# EAGLE design esp-sensor_01 (EAGLE 7.3.0)
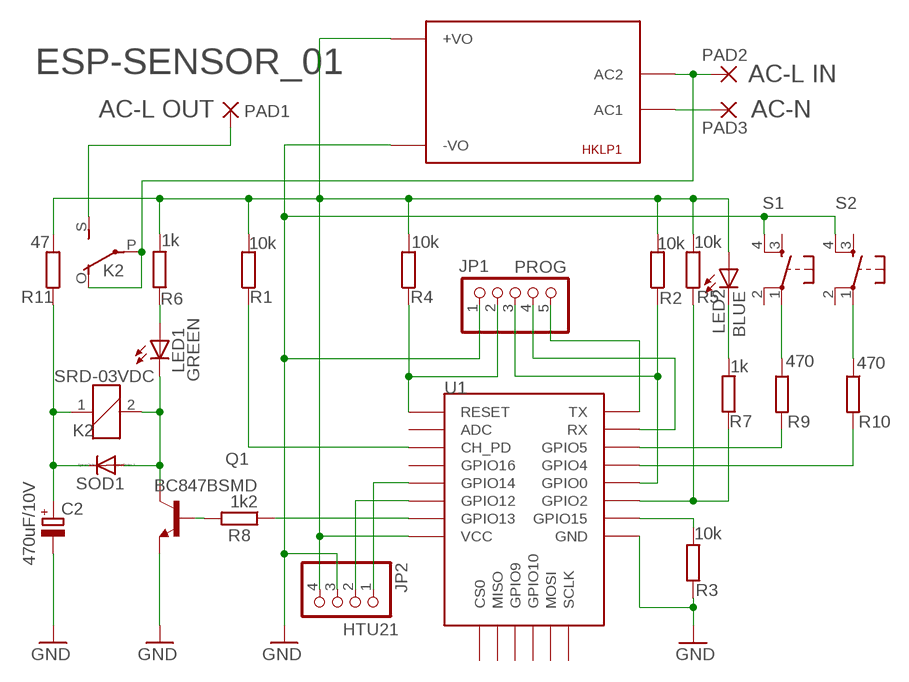
[diagram p0: schematic, sheet 1]

## Parts
C2  470uF/10V  CPOL-EUE3,5-8-B  [E3,5-8-B]
HKLP1  HKLPM01  [HKLPM01]
JP1  PROG  PINHD-1X51X05-2B  [1X05-2B]
JP2  HTU21  PINHD-1X4  [1X04]
K2  SRD-03VDC  G5L-2B  [G5L-2B]
LED1  GREEN  LEDB  [LED3MM-B]
LED2  BLUE  LEDB  [LED3MM-B]
PAD1  3,17/1,1  [3,17/1,1]
PAD2  3,17/1,1  [3,17/1,1]
PAD3  3,17/1,1  [3,17/1,1]
Q1  BC847BSMD  [SOT23]
R1  10k  R-EU_M1206  [M1206]
R2  10k  R-EU_M1206  [M1206]
R3  10k  R-EU_M1206  [M1206]
R4  10k  R-EU_M1206  [M1206]
R5  10k  R-EU_M1206  [M1206]
R6  1k  R-EU_M1206  [M1206]
R7  1k  R-EU_M1206  [M1206]
R8  1k2  R-EU_M1206  [M1206]
R9  470  R-EU_M1206  [M1206]
R10  470  R-EU_M1206  [M1206]
R11  47  R-EU_0207/10-2B  [0207/10-2B]
S1  DTS-6-B  [DTS-6-B]
S2  DTS-6-B  [DTS-6-B]
SOD1  DIODE-MELF-MLL41  [MELF-MLL41]
U1  ESP12ESMD  [ESP12E-SMD]

## Nets
3V3: HKLP1.P$4(+VO) JP2.4 LED2.A R1.2 R2.2 R4.2 R5.2 R6.2 R11.2 U1.VCC
GND: C2.- HKLP1.P$3(-VO) JP1.1 JP2.3 Q1.2(E) R3.1 S1.4 S2.4 U1.GND
N$1: Q1.1(B) R8.2
N$2: C2.+ K2.1 R11.1 SOD1.C
N$3: R8.1 U1.GPIO13
N$4: K2.2 LED1.K(C) Q1.3(C) SOD1.A
N$5: R1.1 U1.CH_PD
N$6: HKLP1.P$2(AC2) K2.O(2:O) K2.P(2:P) PAD2.1(P)
N$8: K2.S(2:S) PAD1.1(P)
N$9: R5.1 R7.1 U1.GPIO2
N$10: R3.2 U1.GPIO15
N$11: JP1.2 R4.1 U1.RESET
N$12: R9.1 S1.1
N$13: R10.1 S2.1
N$14: LED2.K(C) R7.2
N$15: LED1.A R6.1
N$16: JP1.3 R2.1 U1.GPIO0
N$17: JP1.5 U1.TXD0(TX)
N$18: R9.2 U1.GPIO5
N$19: R10.2 U1.GPIO4
N$20: JP1.4 U1.RXD0(RX)
N$21: HKLP1.P$1(AC1) PAD3.1(P)
N$22: JP2.2 U1.GPIO12
N$23: JP2.1 U1.GPIO14
Unconnected: S1.2 S1.3 S2.2 S2.3 U1.ADC U1.CS0 U1.GPIO9 U1.GPIO10 U1.GPIO16 U1.MISO U1.MOSI U1.SCLK

## Notes on the sheet
- ESP-SENSOR_01
- AC-L IN
- AC-L OUT | AC-N

## Library data of the parts
C2 = rcl:CPOL-EU: POLARIZED CAPACITOR, European symbol
HKLP1 = HKLPM01:HKLPM01
JP1 = pinhead:PINHD-1X5: PIN HEADER
JP2 = pinhead:PINHD-1X4: PIN HEADER
K2 = relay:G5L: RELAY 1 x switch, 10 A/120 V AC, 8 A/30 V ADC, Omron
LED1 LED2 = led:LED: LED OSRAM: - CHIPLED LG R971, LG N971, LY N971, LG Q971, LY Q971, LO R971, LY R971 LH N974, LH R974 LS Q976, LO Q976, LY Q976 LO Q996 - Hyper CHIPLED LW Q18S LB Q993, LB Q99A, LB R99A - SideLED LS A670, LO A670, LY A670, LG A670, LP A670 LB A673, LV A673, LT A673, LW A673 LH A674 LY A675 LS A676, LA A676, LO A676, LY A676, LW A676 LS A679, LY A679, LG A679 - Hyper Micro SIDELED® LS Y876, LA Y876, LO Y876, LY Y876 LT Y87S - SmartLED LW L88C, LW L88S LB L89C, LB L89S, LG L890 LS L89K, LO L89K, LY L89K LS L896, LA L896, LO L896, LY L896 - TOPLED LS T670, LO T670, LY T670, LG T670, LP T670 LSG T670, LSP T670, LSY T670, LOP T670, LYG T670 LG T671, LOG T671, LSG T671 LB T673, LV T673, LT T673, LW T673 LH T674 LS T676, LA T676, LO T676, LY T676, LB T676, LH T676, LSB T676, LW T676 LB T67C, LV T67C, LT T67C, LS T67K, LO T67K, LY T67K, LW E67C LS E67B, LA E67B, LO E67B, LY E67B, LB E67C, LV E67C, LT E67C LW T67C LS T679, LY T679, LG T679 LS T770, LO T770, LY T770, LG T770, LP T770 LB T773, LV T773, LT T773, LW T773 LH T774 LS E675, LA E675, LY E675, LS T675 LS T776, LA T776, LO T776, LY T776, LB T776 LHGB T686 LT T68C, LB T68C - Hyper Mini TOPLED® LB M676 - Mini TOPLED Santana® LG M470 LS M47K, LO M47K, LY M47K Source: http://www.osram.convergy.de LUXEON: - LUMILED® LXK2-PW12-R00, LXK2-PW12-S00, LXK2-PW14-U00, LXK2-PW14-V00 LXK2-PM12-R00, LXK2-PM12-S00, LXK2-PM14-U00 LXK2-PE12-Q00, LXK2-PE12-R00, LXK2-PE12-S00, LXK2-PE14-T00, LXK2-PE14-U00 LXK2-PB12-K00, LXK2-PB12-L00, LXK2-PB12-M00, LXK2-PB14-N00, LXK2-PB14-P00, LXK2-PB14-Q00 LXK2-PR12-L00, LXK2-PR12-M00, LXK2-PR14-Q00, LXK2-PR14-R00 LXK2-PD12-Q00, LXK2-PD12-R00, LXK2-PD12-S00 LXK2-PH12-R00, LXK2-PH12-S00 LXK2-PL12-P00, LXK2-PL12-Q00, LXK2-PL12-R00 Source: www.luxeon.com KINGBRIGHT: KA-3528ASYC Source: www.kingbright.com
PAD1-PAD3 = wirepad:3,17/1,1: THROUGH-HOLE PAD
Q1 = transistor-npn:BC847*: NPN Transistor
R1-R11 = rcl:R-EU_: RESISTOR, European symbol
S1 S2 = switch-tact:DTS-6
SOD1 = diode:DIODE-: DIODE
U1 = esp8266modules:ESP12E: ESP12E Module

## Board
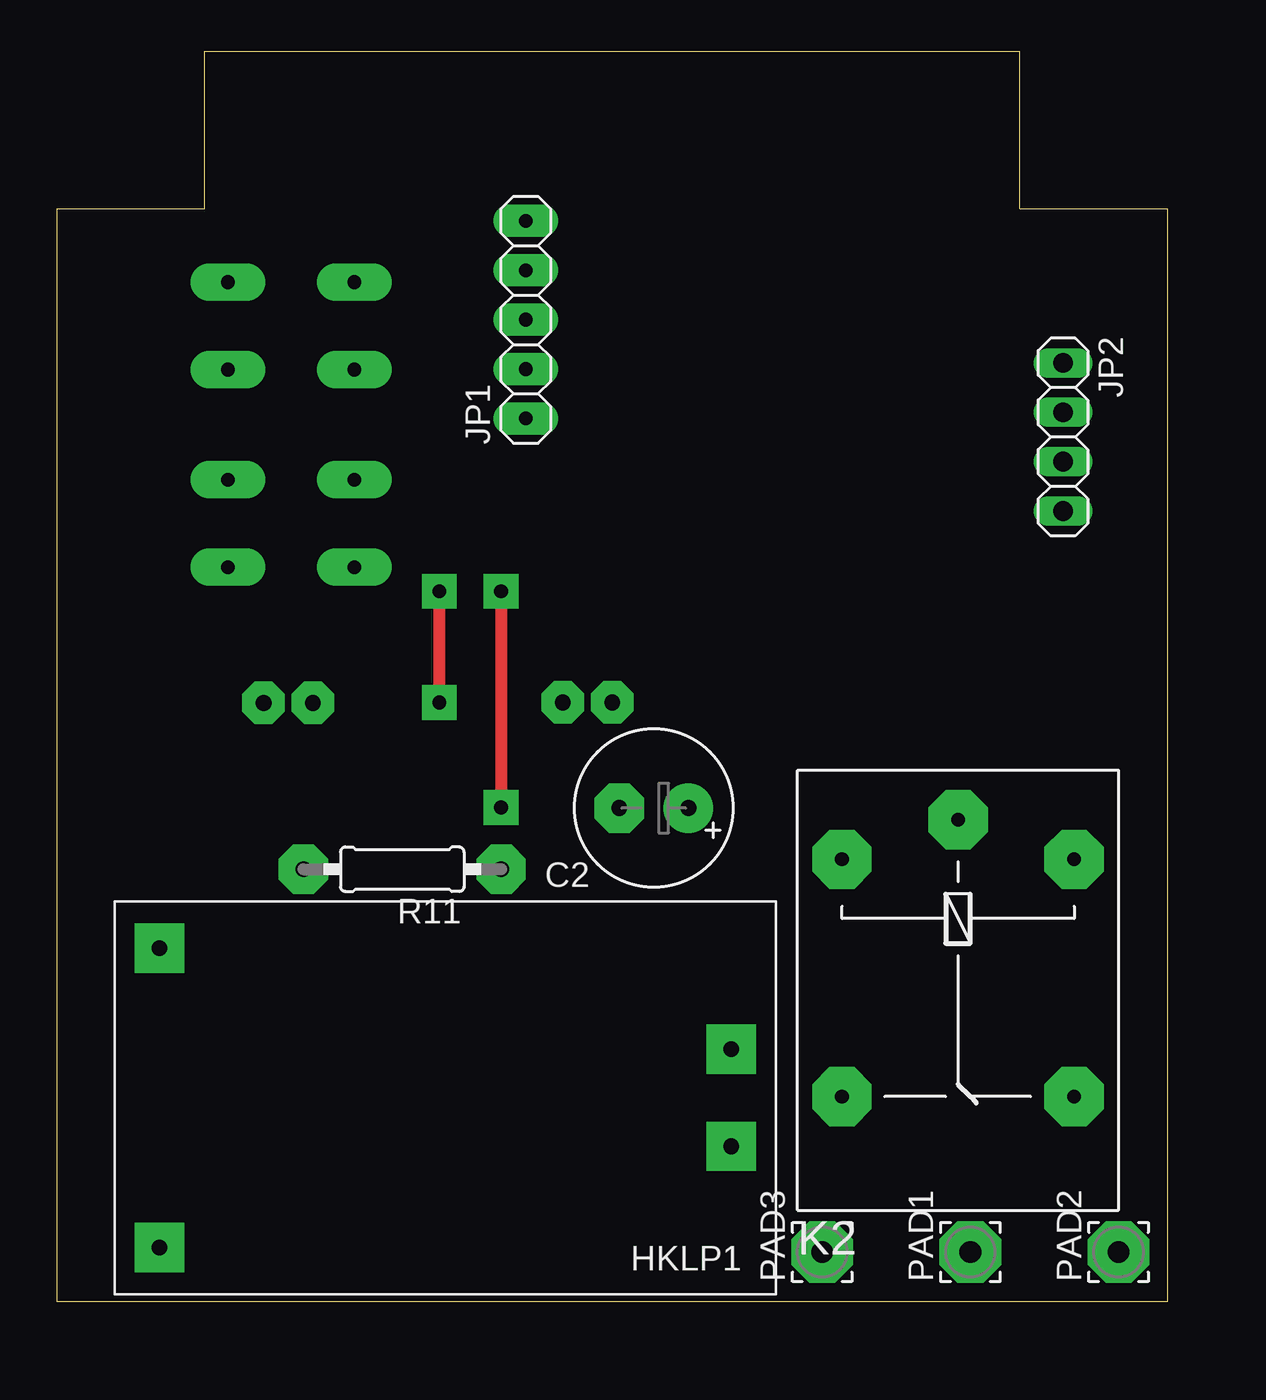
[diagram p1: board, top side]
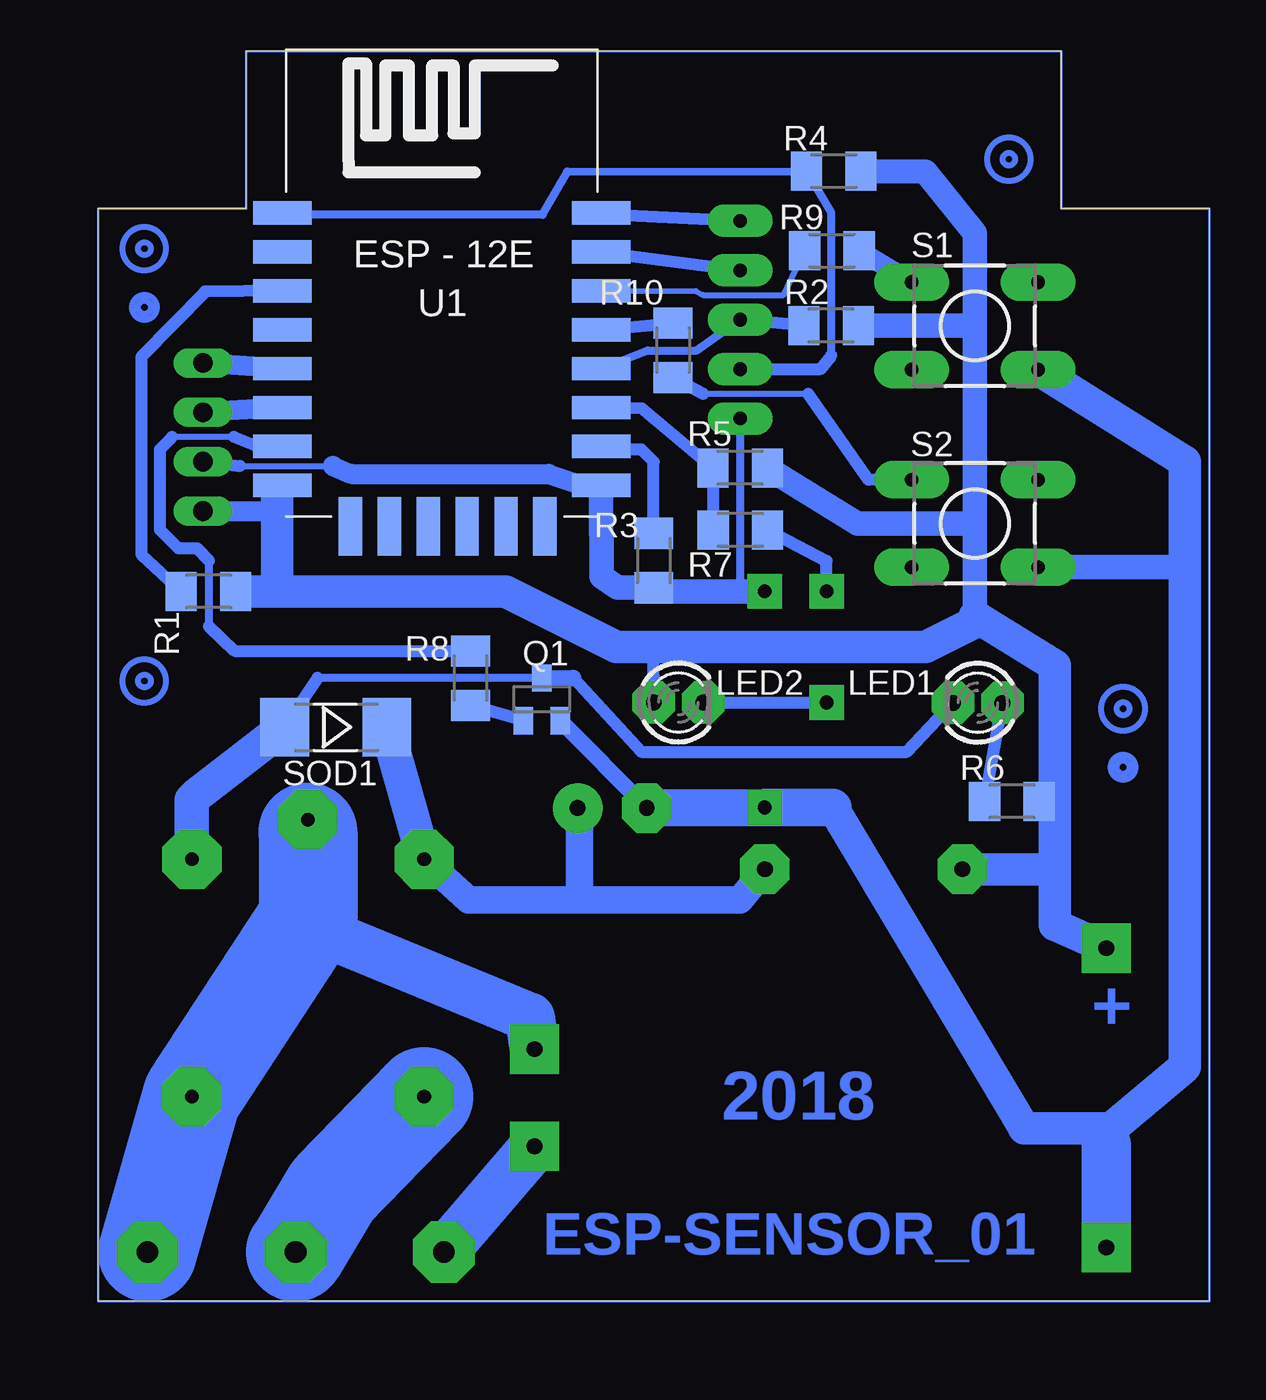
[diagram p2: board, bottom side, seen from below]

Size 57.15 x 64.29 mm. Coordinates in mm from the lower left corner, seen from the top.
Outline: 57.14,56.19 57.14,0 0,0 0,56.19
Outline: 57.15,56.2 49.53,56.2 49.53,64.29 7.62,64.29 7.62,56.2 0,56.2
Copper layers (1*16): Top 0.035mm / dielectric 1.5mm / Bottom 0.035mm
Design rules "default": minimum track width 10mil, minimum drill 24mil, track to track 8mil, track to pad 8mil, pad to pad 8mil, via to via 8mil, smd to smd 8mil, copper to edge 40mil, drill to drill 8mil, minimum pad ring 10mil, minimum via ring 8mil, stop-mask expansion 4mil, vias tented up to drill 0mil, thermal gap 10mil

### Footprints (pad centres in the part's own frame; a part is rotated, then mirrored left to right if it is on the bottom)
E3,5-8-B = drill 0.813 pad 2.54: + -1.778,0 | drill 0.813 pad 2.54 octagon: - 1.778,0
HKLPM01 = drill 0.8 pad 2.54 square: P$1 -14.7,2.5; P$2 -14.7,-2.5; P$3 14.7,7.7; P$4 14.7,-7.7
1X05-2B = drill 0.7 pad 1.676 long: 1 -5.08,0; 2 -2.54,0; 3 0,0; 4 2.54,0; 5 5.08,0
1X04 = drill 1.016 long: 1 -3.81,0; 2 -1.27,0; 3 1.27,0; 4 3.81,0
G5L-2B = drill 0.7 pad 3.048 octagon: 1 -7.493,-5.969; 2 -7.493,5.969; O 4.699,5.969; P -9.525,0; S 4.699,-5.969
LED3MM-B = drill 0.813 pad 2.184 octagon: A -1.27,0; K 1.27,0
3,17/1,1 = drill 1.118 pad 3.175 octagon: 1 0,0
SOT23 = smd 1 x 1.4: 1 -0.95,-1.1; 2 0.95,-1.1; 3 0,1.1
M1206 = smd 1.6 x 2: 1 -1.4,0; 2 1.4,0
0207/10-2B = drill 0.813 pad 2.54 octagon: 1 -5.08,0; 2 5.08,0
DTS-6-B = drill 0.7 pad 1.93 long: 1 -3.25,2.25; 2 3.25,2.25; 3 -3.25,-2.25; 4 3.25,-2.25
MELF-MLL41 = smd 2.5 x 3: A 2.625,0; C -2.625,0
ESP12E-SMD = smd 3 x 1.2: ADC -8.3,3.8; CH_PD -8.3,1.8; GND 8.1,-8.2; GPIO0 8.1,-2.2; GPIO2 8.1,-4.2; GPIO4 8.1,-0.2; GPIO5 8.1,1.8; GPIO12 -8.3,-4.2; GPIO13 -8.3,-6.2; GPIO14 -8.3,-2.2; GPIO15 8.1,-6.2; GPIO16 -8.3,-0.2; RESET -8.3,5.8; RXD0 8.1,3.8; TXD0 8.1,5.8; VCC -8.3,-8.2 | smd 1.2 x 3: CS0 -4.8,-10.3; GPIO9 -0.8,-10.3; GPIO10 1.2,-10.3; MISO -2.8,-10.3; MOSI 3.2,-10.3; SCLK 5.2,-10.3

### Placement (x,y rotation side)
C2  30.71,25.37 180 top
HKLP1  20,10.48 180 top
JP1  24.13,50.48 90 top
JP2  51.75,44.45 270 top
K2  46.35,15.24 270 top
LED1  11.92,30.78 180 bottom
LED2  27.3,30.81 0 bottom
PAD1  46.99,2.54 90 top
PAD2  54.61,2.54 90 top
PAD3  39.37,2.54 90 top
Q1  34.33,30.96 0 bottom
R1  51.47,36.51 0 bottom
R2  19.45,50.18 0 bottom
R3  28.57,38.1 90 bottom
R4  19.32,58.11 0 bottom
R5  24.13,42.86 0 bottom
R6  10.16,25.72 0 bottom
R7  24.12,39.66 0 bottom
R8  37.99,32.05 270 bottom
R9  19.41,54.03 180 bottom
R10  27.59,48.91 90 bottom
R11  17.78,22.23 180 top
S1  12.06,50.16 0 bottom
S2  12.06,40.01 0 bottom
SOD1  44.93,29.53 180 bottom
U1  39.37,50.16 0 bottom

### Tracks (layer width: path | path; a pad name or v marks a point on that pad's centre or on a via)
3V3
  Bottom 0.305: R6.2 7.94,26.67
  Bottom 0.406: R1.2 49.53,36.51 | 47.94,36.83 47.94,36.51
  Bottom 0.61: LED2.A 28.57,33.66
  Bottom 0.813: 47.94,41.59 U1.VCC
  Bottom 1.016: 47.94,36.83 47.97,39.05 | JP2.4 47.94,40.64
  Bottom 1.27: 12.06,35.24 12.06,40.01 | 12.06,40.01 12.06,50.16 | 12.06,50.16 12.06,54.93 14.61,58.1 R4.2 | R2.2 12.54,50.17 12.06,50.16 | R5.2 18.1,40.01 12.06,40.01
  Bottom 1.676: 47.94,36.83 47.94,40.64 47.94,41.59 | 49.53,36.51 47.94,36.51 36.2,36.51 30.48,33.66 28.57,33.66 14.61,33.66 11.78,35.07 | 7.94,22.23 7.94,19.37 HKLP1.P$4 | 7.94,22.23 7.94,26.67 7.94,32.7 11.78,35.07 | 11.78,35.07 12.06,35.24 | R11.2 7.94,22.23
GND  (via drill 0.7 pad 1.78)
  Top 0.61: v22.86,36.51 v22.86,25.4
  Bottom 0.305: 1.89,37.76 1.27,37.78 | 49.85,42.97 45.09,42.97
  Bottom 0.406: JP1.1 24.13,36.51
  Bottom 0.61: 31.27,41.38 U1.GND | 27.94,36.51 R3.1 | JP2.3 49.85,42.97
  Bottom 0.813: C2.- Q1.2
  Bottom 1.016: U1.GND 32.07,41.91 33.97,42.55 44.13,42.55 45.09,42.97
  Bottom 1.27: 5.32,8.06 5.24,8.89 | S2.4 1.89,37.76 | R3.1 30.43,36.7 31.27,37.28 31.27,41.38 | v22.86,36.51 24.13,36.51 27.94,36.51
  Bottom 1.676: 19.37,25.4 9.53,8.89 5.24,8.89 5.24,8.73 1.27,12.06 1.27,37.78 1.27,43.18 S1.4
  Bottom 1.93: 19.37,25.4 v22.86,25.4 C2.-
  Bottom 2.54: HKLP1.P$3 5.32,8.06
N$1
  Bottom 0.61: Q1.1 R8.2
N$2
  Bottom 0.406: C2.+ 32.38,24.77
  Bottom 1.422: R11.1 24.13,20.64 32.38,20.64 | 32.38,20.64 38.1,20.64 K2.1 | 32.38,20.64 32.38,24.77
  Bottom 1.778: SOD1.C K2.1
N$3
  Bottom 0.305: 50.16,44.45 53.34,44.45
  Bottom 0.406: 48.58,43.81 48.26,43.81 U1.GPIO13 | 51.46,38.09 51.46,34.72
  Bottom 0.61: R8.1 50.12,33.45 51.46,34.72 | 48.58,43.81 50.16,44.45 | 53.34,44.45 53.98,43.81 53.98,39.69 53.02,38.73 52.07,38.73 51.46,38.09
N$4
  Bottom 0.406: Q1.3 45.86,32.07
  Bottom 0.61: 45.86,32.07 SOD1.A | 32.7,32.07 29.21,28.26 15.56,28.26 LED1.K
  Bottom 0.813: Q1.3 32.7,32.07
  Bottom 1.778: SOD1.A 52.07,26.04 52.32,25.78 K2.2
N$5
  Bottom 0.61: U1.CH_PD 51.65,51.94 54.93,48.58 54.93,38.42 R1.1
N$6
  Bottom 1.422: K2.P 46.35,24.13
  Bottom 2.54: HKLP1.P$2 34.92,14.61 46.55,19.39
  Bottom 5.08: PAD2.1 K2.O 46.55,19.39 46.35,19.68 46.35,24.13
N$7
  Bottom 0.127: 0,0 57.15,0 57.15,56.2 49.53,56.2 49.53,64.29 7.62,64.29 7.62,56.2 0,56.2 0,0
N$8
  Bottom 5.08: K2.S 45.09,5.71 PAD1.1
N$9
  Bottom 0.61: U1.GPIO2 29.2,45.93 R5.1 R7.1
N$10
  Bottom 0.406: 30.16,43.81 U1.GPIO15
  Bottom 0.61: R3.2 28.57,43.18 29.21,43.81 30.16,43.81
N$11
  Bottom 0.406: U1.RESET 47.59,55.88 34.29,55.88 33.02,58.1 R4.1 19.45,55.95 19.45,48.65
  Bottom 0.61: JP1.2 20,47.94 19.45,48.65
N$12
  Bottom 1.016: S1.1 R9.1
N$13
  Bottom 0.305: 26.04,46.67 20.64,46.67
  Bottom 0.61: R10.1 26.04,46.67 | 20.64,46.67 17.53,42.25 S2.1
N$14  (via drill 0.7 pad 1.78)
  Top 0.61: v19.68,30.8 v19.68,36.51
  Bottom 0.61: LED2.K v19.68,30.8 | v19.68,36.51 19.69,38.08 R7.2
N$15
  Bottom 0.61: R6.1 LED1.A
N$16
  Bottom 0.406: U1.GPIO0 28.89,48.9 26.38,48.9 JP1.3
  Bottom 0.61: R2.1 JP1.3
N$17
  Bottom 0.406: 30.48,55.88 U1.TXD0
  Bottom 0.61: 30.48,55.88 JP1.5
N$18
  Bottom 0.305: U1.GPIO5 26.42,51.96 26.04,51.75 21.92,51.75 R9.2
N$19
  Bottom 0.61: U1.GPIO4 R10.2
N$20
  Bottom 0.61: U1.RXD0 JP1.4
N$21
  Bottom 2.54: HKLP1.P$1 PAD3.1
N$22
  Bottom 1.016: U1.GPIO12 JP2.2
N$23
  Bottom 1.016: U1.GPIO14 JP2.1
(copper drawn outside any net)
  shapes: Bottom circle x12

### Text on the board
Bottom: + | 2018 | ESP-SENSOR_01